# EAGLE schematic IO Bottom (EAGLE 9.6.2)
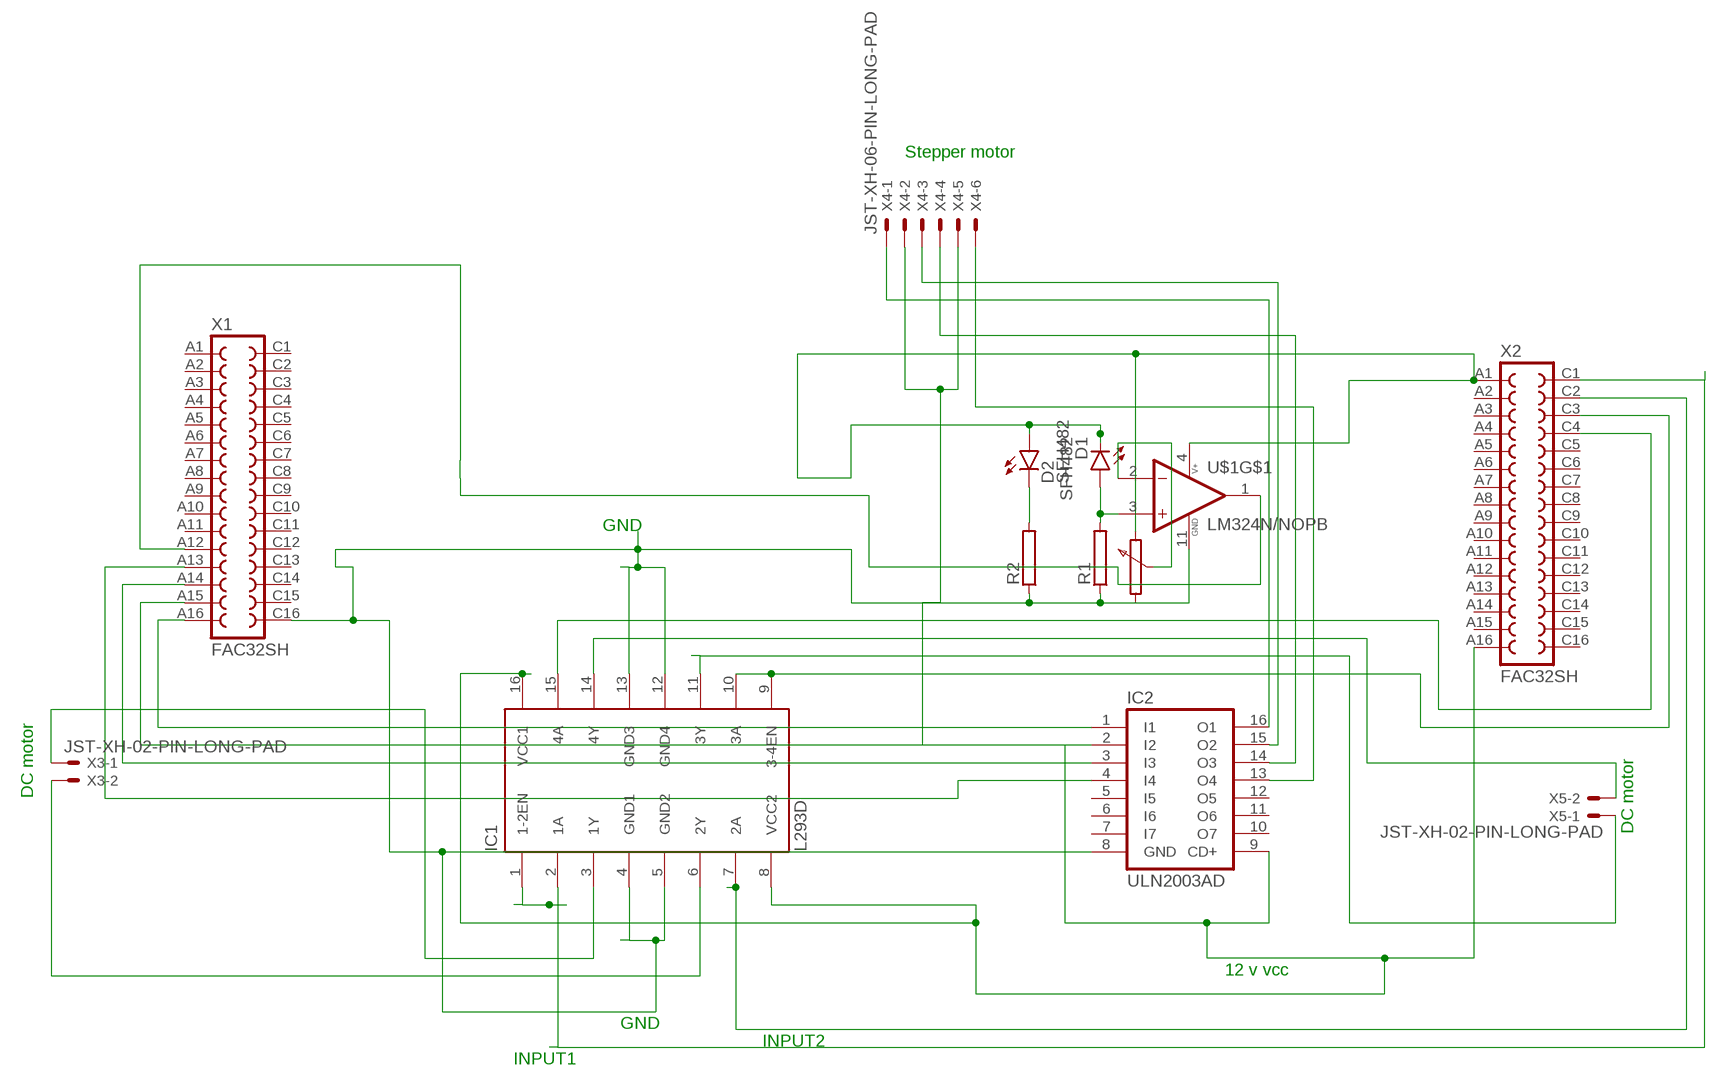
[diagram p0: schematic, sheet 1]

## Parts
D1  SFH482  [SFH482]
D2  SFH482  [SFH482]
IC1  L293D  [DIL16]
IC2  ULN2003AD  [SO16]
R1  RMG100-H  [TO-247-2H]
R2  RMG100-H  [TO-247-2H]
U$1  LM324N/NOPB  [DIP825W47P254L1917H533Q14]
X1  FAC32SH  [FAC32SH]
X2  FAC32SH  [FAC32SH]
X3  JST-XH-02-PIN-LONG-PAD  [JST-XH-02-PACKAGE-LONG-PAD]
X4  JST-XH-06-PIN-LONG-PAD  [JST-XH-06-PACKAGE-LONG-PAD]
X5  JST-XH-02-PIN-LONG-PAD  [JST-XH-02-PACKAGE-LONG-PAD]

## Nets
N$1: IC1.3(1Y) X3.1
N$2: IC1.6(2Y) X3.2
N$3: IC1.14(4Y) X5.2
N$4: IC1.11(3Y) X5.1
N$5: IC1.2(1A) X2.C1
N$6: U$1.2(1IN-)
N$7: D2.K(C) R2.2
N$8: IC1.7(2A) X2.C2
N$9: D1.A R1.2 U$1.3(1IN+)
N$10: IC2.16(O1) X4.1
N$11: IC2.15(O2) X4.3
N$12: IC2.14(O3) X4.4
N$13: IC2.13(O4) X4.6
N$14: U$1.1(1OUT) X1.A12
N$15: IC1.1(1-2EN)
N$16: IC1.4(GND1) IC1.5(GND2) IC1.12(GND4) IC1.13(GND3) IC2.8(GND) R1.1 R2.1 U$1.11(GND) X1.C16
N$17: IC2.1(I1) X1.A16
N$18: IC2.2(I2) X1.A15
N$19: IC2.3(I3) X1.A14
N$20: IC2.4(I4) X1.A13
N$21: IC1.9(3-4EN) IC1.10(3A) X2.C3
N$22: IC1.15(4A) X2.C4
N$25: IC1.8(VCC2) IC1.16(VCC1) IC2.9(CD+) X2.A16 X4.2 X4.5
N$26: D1.K(C) D2.A U$1.4(V+) X2.A1
Unconnected: IC2.5(I5) IC2.6(I6) IC2.7(I7) IC2.10(O7) IC2.11(O6) IC2.12(O5) U$1.5(2IN+) U$1.6(2IN-) U$1.7(2OUT) U$1.8(3OUT) U$1.9(3IN-) U$1.10(3IN+) U$1.12(4IN+) U$1.13(4IN-) U$1.14(4OUT) X1.A1 X1.A2 X1.A3 X1.A4 X1.A5 X1.A6 X1.A7 X1.A8 X1.A9 X1.A10 X1.A11 X1.C1 X1.C2 X1.C3 X1.C4 X1.C5 X1.C6 X1.C7 X1.C8 X1.C9 X1.C10 X1.C11 X1.C12 X1.C13 X1.C14 X1.C15 X2.A2 X2.A3 X2.A4 X2.A5 X2.A6 X2.A7 X2.A8 X2.A9 X2.A10 X2.A11 X2.A12 X2.A13 X2.A14 X2.A15 X2.C5 X2.C6 X2.C7 X2.C8 X2.C9 X2.C10 X2.C11 X2.C12 X2.C13 X2.C14 X2.C15 X2.C16

## Notes on the sheet
- Stepper motor
- GND
- DC motor
- DC motor
- 12 v vcc
- GND
- INPUT2
- INPUT1

## Library data of the parts
D1 D2 = led:SFH482: IR LED infrared emitting diode, Infineon
IC1 = st-microelectronics:L293D: PUSH-PULL 4 CHANNEL DRIVER; MPN: L293D; OC_FARNELL: 9589619; OC_NEWARK: 56P8249
IC2 = uln-udn:ULN2003A: DRIVER ARRAY
R1 R2 = resistor-power:RMG100: TO-247 Power Resistor - RMG 100 Series Source: www.token.com.tw .. power-resistor-rmg100pdf; OC_FARNELL: unknown; OC_NEWARK: unknown
U$1 = LM324N:LM324N/NOPB: Check prices <https://pricing.snapeda.com/search/part/LM324N/?ref=eda>; AVAILABILITY: Good; DESCRIPTION: 4-Channel industry standard operational amplifier 14-PDIP 0 to 70; MF: Texas Instruments; MP: LM324N; PACKAGE: PDIP-14 Texas Instruments; PRICE: None; PURCHASE-URL: https://pricing.snapeda.com/search/part/LM324N/?ref=eda
X1 X2 = con-vg:FAC32SH: CONNECTOR female, 32 pins, block, type B, rows AC, grid 5.08 mm
X3 X5 = Rembrandt Electronics - JST XH Connectors v1-0:JST-XH-02-PIN: JST XH Connector 2 Pin Wire to board connector. Pitch: 2,54 mm, (0.100") Number of pins: 2 Created by Rembrandt Electronics www.rembrandtelectronics.com
X4 = Rembrandt Electronics - JST XH Connectors v1-0:JST-XH-06-PIN: JST XH Connector 2 Pin Wire to board connector. Pitch: 2,54 mm, (0.100") Number of pins: 6 Created by Rembrandt Electronics www.rembrandtelectronics.com